# EAGLE design CT Amp (EAGLE 7.5.0)
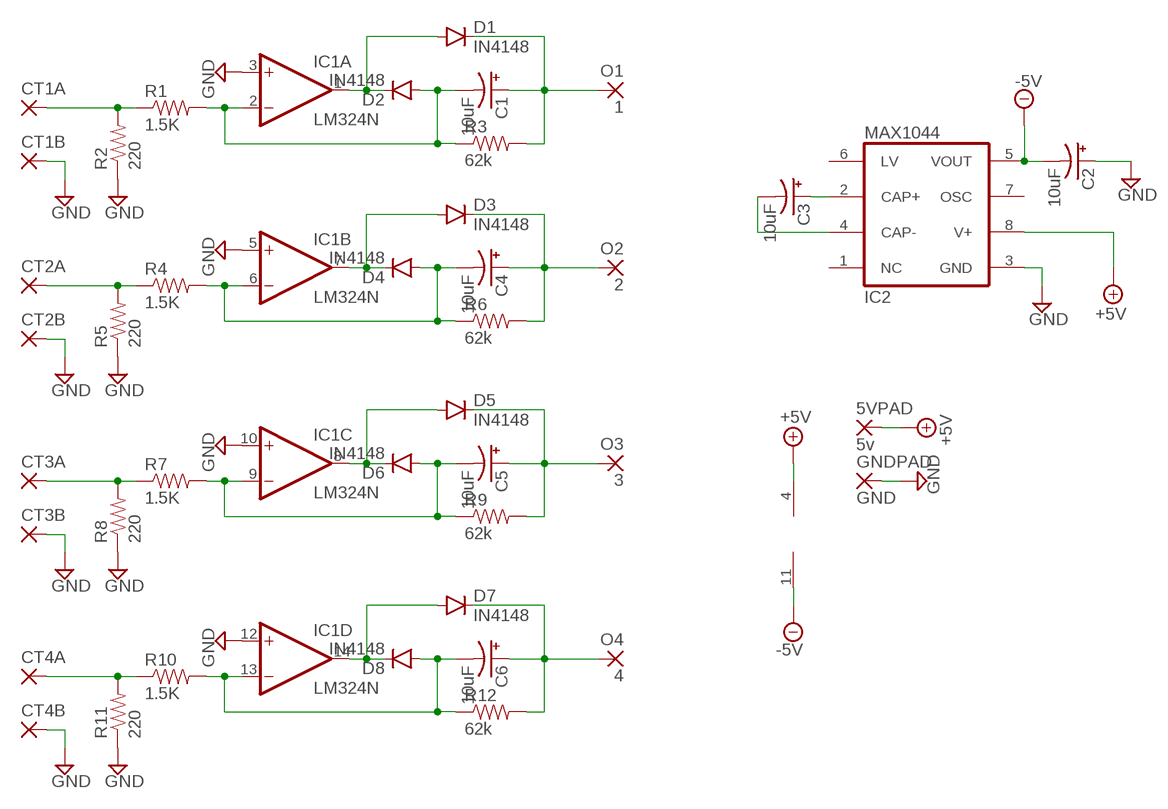
[diagram p0: schematic, sheet 1]

## Parts
5VPAD  5v  2,54/1,0  [2,54/1,0]
C1  10uF  CPOL-USE2.5-6  [E2,5-6]
C2  10uF  CPOL-USE2.5-6  [E2,5-6]
C3  10uF  CPOL-USE2.5-6  [E2,5-6]
C4  10uF  CPOL-USE2.5-6  [E2,5-6]
C5  10uF  CPOL-USE2.5-6  [E2,5-6]
C6  10uF  CPOL-USE2.5-6  [E2,5-6]
CT1A  2,54/1,0  [2,54/1,0]
CT1B  2,54/1,0  [2,54/1,0]
CT2A  2,54/1,0  [2,54/1,0]
CT2B  2,54/1,0  [2,54/1,0]
CT3A  2,54/1,0  [2,54/1,0]
CT3B  2,54/1,0  [2,54/1,0]
CT4A  2,54/1,0  [2,54/1,0]
CT4B  2,54/1,0  [2,54/1,0]
D1  IN4148  DIODEPTH  [DIODE-1N4001]
D2  IN4148  DIODEPTH  [DIODE-1N4001]
D3  IN4148  DIODEPTH  [DIODE-1N4001]
D4  IN4148  DIODEPTH  [DIODE-1N4001]
D5  IN4148  DIODEPTH  [DIODE-1N4001]
D6  IN4148  DIODEPTH  [DIODE-1N4001]
D7  IN4148  DIODEPTH  [DIODE-1N4001]
D8  IN4148  DIODEPTH  [DIODE-1N4001]
GNDPAD  GND  2,54/1,0  [2,54/1,0]
IC1  LM324N  [DIL14]
MAX1044  IC2  ICL7660CPA  [DIL08]
O1  1  2,54/1,0  [2,54/1,0]
O2  2  2,54/1,0  [2,54/1,0]
O3  3  2,54/1,0  [2,54/1,0]
O4  4  2,54/1,0  [2,54/1,0]
R1  1.5K  RESISTORPTH-1/4W  [AXIAL-0.4]
R2  220  RESISTORPTH-1/4W  [AXIAL-0.4]
R3  62k  RESISTORPTH-1/4W  [AXIAL-0.4]
R4  1.5K  RESISTORPTH-1/4W  [AXIAL-0.4]
R5  220  RESISTORPTH-1/4W  [AXIAL-0.4]
R6  62k  RESISTORPTH-1/4W  [AXIAL-0.4]
R7  1.5K  RESISTORPTH-1/4W  [AXIAL-0.4]
R8  220  RESISTORPTH-1/4W  [AXIAL-0.4]
R9  62k  RESISTORPTH-1/4W  [AXIAL-0.4]
R10  1.5K  RESISTORPTH-1/4W  [AXIAL-0.4]
R11  220  RESISTORPTH-1/4W  [AXIAL-0.4]
R12  62k  RESISTORPTH-1/4W  [AXIAL-0.4]

## Nets
+5V: 5VPAD.1(P) IC1.4(P:V+) MAX1044.8(V+)
-5V: C2.- IC1.11(P:V-) MAX1044.5(VOUT)
GND: C2.+ CT1B.1(P) CT2B.1(P) CT3B.1(P) CT4B.1(P) GNDPAD.1(P) IC1.3(A:+IN) IC1.5(B:+IN) IC1.10(C:+IN) IC1.12(D:+IN) MAX1044.3(GND) R2.P$1 R5.P$1 R8.P$1 R11.P$1
N$1: C3.+ MAX1044.2(CAP+)
N$2: C3.- MAX1044.4(CAP-)
N$3: CT2A.1(P) R4.P$1 R5.P$2
N$4: C1.- D2.A IC1.2(A:-IN) R1.P$2 R3.P$1
N$5: C5.- D6.A IC1.9(C:-IN) R7.P$2 R9.P$1
N$6: CT3A.1(P) R7.P$1 R8.P$2
N$8: D1.A D2.C IC1.1(A:OUT)
N$9: D5.A D6.C IC1.8(C:OUT)
N$10: C5.+ D5.C O3.1(P) R9.P$2
N$11: C6.- D8.A IC1.13(D:-IN) R10.P$2 R12.P$1
N$12: C4.- D4.A IC1.6(B:-IN) R4.P$2 R6.P$1
N$13: D7.A D8.C IC1.14(D:OUT)
N$14: C6.+ D7.C O4.1(P) R12.P$2
N$16: C1.+ D1.C O1.1(P) R3.P$2
N$17: CT1A.1(P) R1.P$1 R2.P$2
N$20: CT4A.1(P) R10.P$1 R11.P$2
N$21: D3.A D4.C IC1.7(B:OUT)
N$22: C4.+ D3.C O2.1(P) R6.P$2
Unconnected: MAX1044.1(NC) MAX1044.6(LV) MAX1044.7(OSC)

## Library data of the parts
5VPAD CT1A CT1B CT2A CT2B CT3A CT3B CT4A CT4B GNDPAD O1-O4 = wirepad:2,54/1,0: THROUGH-HOLE PAD
C1-C6 = adafruit:CPOL-US: POLARIZED CAPACITOR, American symbol
D1-D8 = SparkFun-DiscreteSemi:DIODE: Diode These are standard reverse protection diodes and small signal diodes. SMA package can handle up to about 1A. SOD-323 can handle about 200mA. What the SOD-323 package when ordering, there are some mfgs out there that are 5-pin packages.
IC1 = linear:LM324: OP AMP
MAX1044 = maxim:ICL7660CPA: VOLTAGE CONVERTER; MF: INTERSIL; MPN: ICL7660CPA; OC_FARNELL: 1018170; OC_NEWARK: 06F7441
R1-R12 = SparkFun-Resistors:RESISTOR: Resistor Basic schematic elements and footprints for 0603, 1206, and PTH resistors.

## Net classes
0 default: width 0.305 mm, drill 1 mm, clearance 0.254 mm

## Board
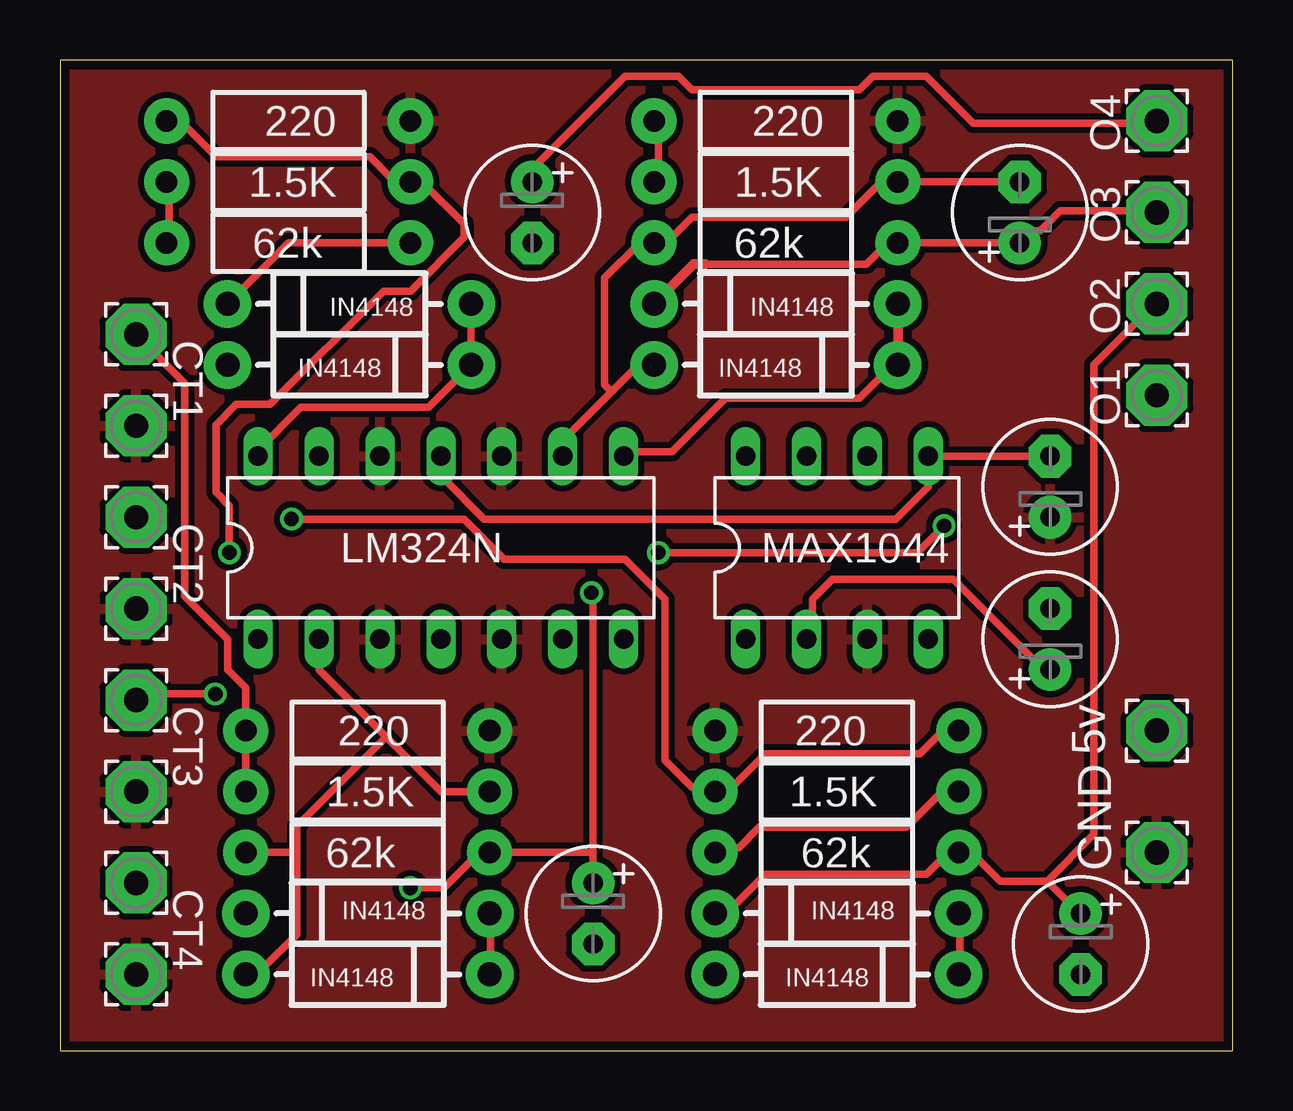
[diagram p1: board, top side]
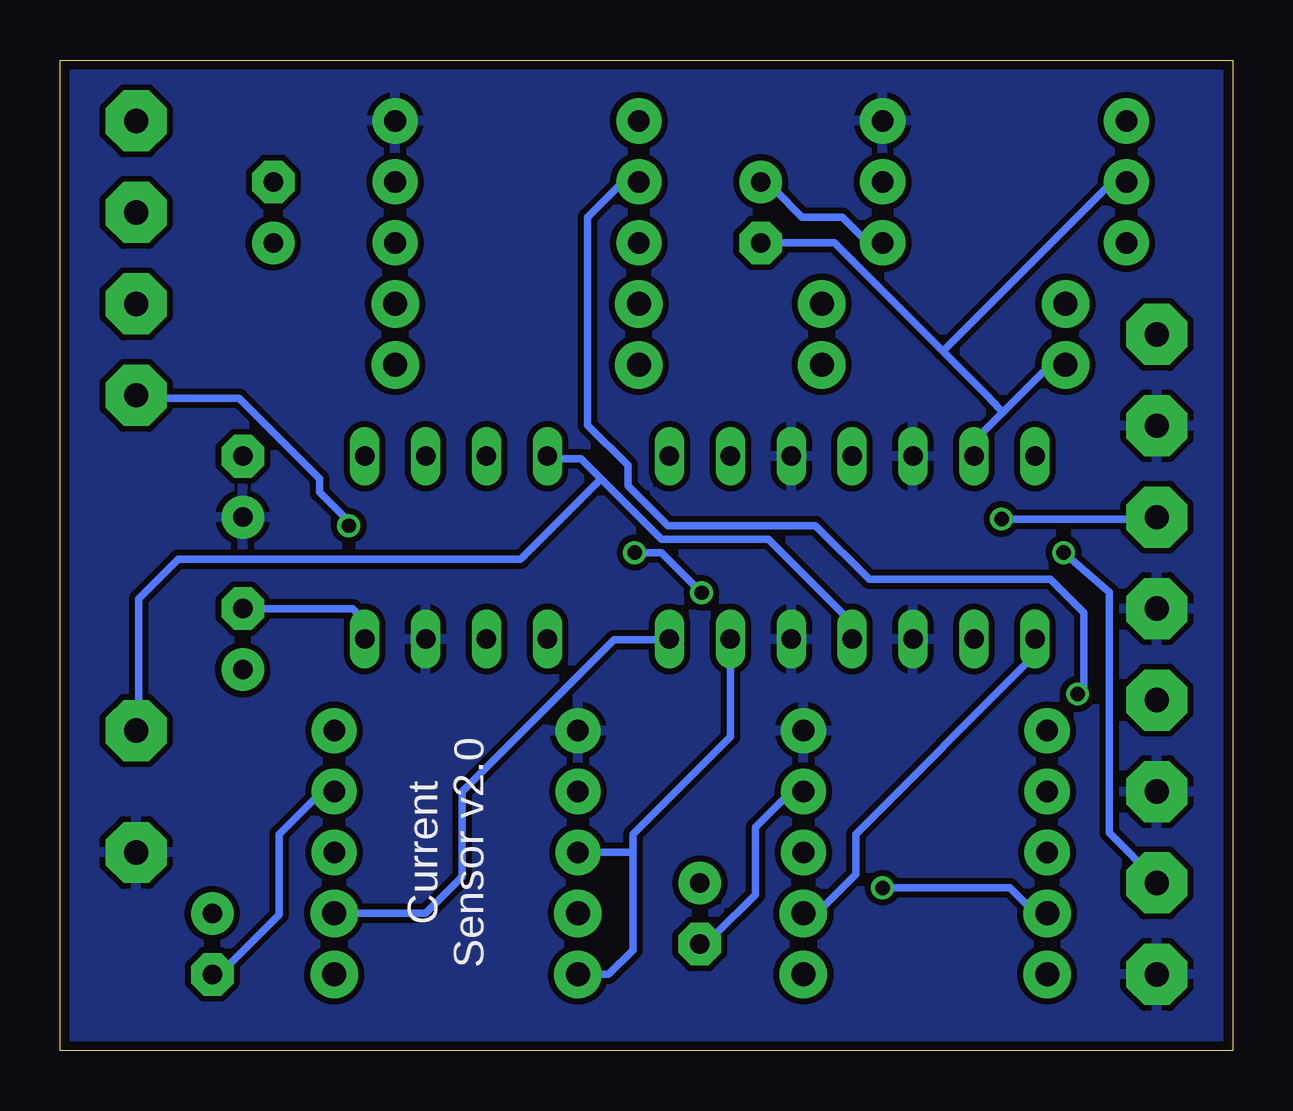
[diagram p2: board, bottom side, seen from below]

Size 48.89 x 41.27 mm. Coordinates in mm from the lower left corner, seen from the top.
Outline: 0,0 48.89,0 48.89,41.27 0,41.27 0,0
Copper layers (1*16): Top 0.0356mm / dielectric 1.5011mm / Bottom 0.0356mm
Design rules "OSH_Park": minimum track width 6mil, minimum drill 13mil, track to track 6mil, track to pad 6mil, pad to pad 6mil, via to via 6mil, smd to smd 6mil, copper to edge 15mil, drill to drill 6mil, minimum pad ring 7mil, minimum via ring 7mil, stop-mask expansion 4mil, vias tented up to drill 0mil, thermal gap 10mil

### Footprints (pad centres in the part's own frame; a part is rotated, then mirrored left to right if it is on the bottom)
2,54/1,0 = drill 1.016 pad 2.54 octagon: 1 0,0
E2,5-6 = drill 0.813 pad 1.778: + -1.27,0 | drill 0.813 pad 1.778 octagon: - 1.27,0
DIODE-1N4001 = drill 1 pad 1.981: A -5.08,0; C 5.08,0
DIL14 = drill 0.813 long: 1 -7.62,-3.81; 2 -5.08,-3.81; 3 -2.54,-3.81; 4 0,-3.81; 5 2.54,-3.81; 6 5.08,-3.81; 7 7.62,-3.81; 8 7.62,3.81; 9 5.08,3.81; 10 2.54,3.81; 11 0,3.81; 12 -2.54,3.81; 13 -5.08,3.81; 14 -7.62,3.81
DIL08 = drill 0.813 long: 1 -3.81,-3.81; 2 -1.27,-3.81; 3 1.27,-3.81; 4 3.81,-3.81; 5 3.81,3.81; 6 1.27,3.81; 7 -1.27,3.81; 8 -3.81,3.81
AXIAL-0.4 = drill 0.9 pad 1.88: P$1 -5.08,0; P$2 5.08,0

### Placement (x,y rotation side)
5VPAD  45.72,13.33 90 top
C1  22.23,5.71 270 top
C2  41.27,23.5 90 top
C3  41.27,17.15 90 top
C4  42.54,4.45 270 top
C5  40,34.92 90 top
C6  19.69,34.92 270 top
CT1A  3.17,29.85 270 top
CT1B  3.17,26.04 0 top
CT2A  3.17,22.23 270 top
CT2B  3.17,18.42 270 top
CT3A  3.17,14.61 270 top
CT3B  3.17,10.79 270 top
CT4A  3.17,6.98 270 top
CT4B  3.17,3.17 270 top
D1  12.83,5.71 180 top
D2  12.83,3.17 0 top
D3  32.38,5.71 180 top
D4  32.38,3.17 0 top
D5  29.85,31.12 180 top
D6  29.85,28.58 0 top
D7  12.06,31.12 180 top
D8  12.06,28.58 0 top
GNDPAD  45.72,8.26 90 top
IC1  15.88,20.96 0 top
MAX1044  32.38,20.96 0 top
O1  45.72,27.31 90 top
O2  45.72,31.12 90 top
O3  45.72,34.92 90 top
O4  45.72,38.73 90 top
R1  12.83,10.79 0 top
R2  12.83,13.33 180 top
R3  12.83,8.26 0 top
R4  32.38,10.79 0 top
R5  32.38,13.33 0 top
R6  32.38,8.26 0 top
R7  29.85,36.2 0 top
R8  29.85,38.73 180 top
R9  29.85,33.66 0 top
R10  9.53,36.2 180 top
R11  9.53,38.73 180 top
R12  9.53,33.66 0 top

### Tracks (layer width: path | path; a pad name or v marks a point on that pad's centre or on a via)
+5V
  Bottom 0.305: 26.34,23.83 27.18,24.66 28.58,24.66 MAX1044.8 | 26.34,23.83 23.83,21.31 19.36,21.31 16,17.96 16,17.4 IC1.4 | 26.34,23.83 29.69,20.47 43.97,20.47 45.62,18.82 45.62,13.49 5VPAD.1
-5V
  Top 0.305: IC1.11 16,24.66 16,23.83 17.68,22.15 34.85,22.15 36.2,23.5 MAX1044.5 | 36.12,24.66 MAX1044.5 | MAX1044.5 C2.-
GND
  pour Top: -0.64,42.54 48.89,43.81 48.89,-0.64 -0.64,-0.64
  pour Bottom: -0.64,41.27 51.43,41.27 50.16,-0.64 -0.64,-0.64
N$1
  Top 0.305: MAX1044.2 31.37,17.4 31.37,18.8 32.21,19.63 37.24,19.63 40.59,16.28 41.15,16.28 C3.+
N$2
  Bottom 0.305: MAX1044.4 36.2,17.91 36.7,18.42 C3.-
N$3  (via drill 0.6)
  Top 0.305: R5.P$2 37.24,13.21 36.68,13.21 35.84,12.37 29.41,12.37 28.02,10.97 27.46,10.97 R4.P$1 27.18,10.97 26.34,10.97 25.22,12.09 25.22,18.8 23.55,20.47 18.52,20.47 16.84,22.15 v9.65,22.15
  Bottom 0.305: v9.65,22.15 3.43,22.15 CT2A.1
N$4
  Top 0.305: 9.86,8.26 9.86,9.35 13.59,13.08 | 9.86,8.26 9.86,4.83 8.46,3.43 7.9,3.43 D2.A | IC1.2 10.79,15.88 13.59,13.08 | 13.59,13.08 15.88,10.79 R1.P$2 | R3.P$1 9.86,8.26
  Bottom 0.305: C1.- 22.15,4.83 21.59,4.83 19.91,6.5 19.91,9.3 18.52,10.69 17.96,10.69 R1.P$2
N$5
  Top 0.305: 22.99,27.46 24.11,28.58 D6.A | 22.99,27.46 21.03,25.5 21.03,24.94 IC1.9 | 22.99,27.46 22.71,27.74 22.71,32.21 24.11,33.6 24.66,33.6 R9.P$1 24.94,33.88 25.5,33.88 26.34,34.72 32.77,34.72 34.16,36.12 34.72,36.12 R7.P$2 C5.-
N$6  (via drill 0.6)
  Top 0.305: R7.P$1 24.94,36.4 24.94,38.63 R8.P$2 | v6.48,14.86 3.43,14.86 CT3A.1
  Bottom 0.305: R7.P$1 24.94,36.12 25.5,36.12 26.9,34.72 26.9,26.06 25.22,24.38 25.22,23.55 23.55,21.87 17.4,21.87 15.16,19.63 7.62,19.63 6.22,18.24 6.22,15.11 v6.48,14.86
N$8
  Top 0.305: D2.C 17.96,3.43 17.96,5.66 D1.A
  Bottom 0.305: IC1.1 8.46,17.12 8.46,16.28 15.72,9.02 15.72,7.34 17.12,5.94 17.68,5.94 D1.A
N$9
  Top 0.305: IC1.8 23.55,24.94 25.5,24.94 27.74,27.18 33.32,27.18 34.72,28.58 D6.C 35,28.58
  Top 0.406: D5.A D6.C
N$10
  Top 0.305: O3.1 45.62,35 41.71,35 40.87,34.16 40.03,34.16 C5.+ R9.P$2 34.72,33.88 33.6,32.77 26.9,32.77
  Top 0.406: 26.9,32.77 26.42,32.77 D5.C
N$11
  Top 0.305: R12.P$1 4.55,33.88 4.55,36.12 R10.P$2
  Bottom 0.305: 9.59,26.61 7.62,28.58 D8.A | 9.59,26.61 10.69,25.5 10.69,24.94 IC1.13 | 12.09,29.13 10.13,27.18 10.13,27.15 9.59,26.61 | 12.09,29.13 16.61,33.66 19.05,33.66 19.08,33.88 19.63,33.88 C6.- | 12.09,29.13 5.1,36.12 4.55,36.12 R10.P$2
N$12
  Top 0.305: R4.P$2 37.24,10.69 36.68,10.69 35.28,9.3 29.13,9.3 28.3,8.46 27.46,8.46 R6.P$1
  Bottom 0.305: C4.- 41.99,3.43 39.75,5.66 39.75,9.02 38.07,10.69 37.52,10.69 R4.P$2 | IC1.6 20.96,13.08 25.02,9.02 25.02,8.26 | 25.02,8.26 25.02,4.19 26.04,3.17 D4.A | R6.P$1 25.02,8.26
N$13
  Top 0.305: IC1.14 8.26,25.02 10.03,26.8 15.37,26.8 D8.C D7.A
N$14
  Top 0.305: O4.1 45.62,38.63 38.07,38.63 36.12,40.59 33.88,40.59 33.32,40.03 26.34,40.03 25.78,40.59 23.55,40.59 19.63,36.68 19.63,36.12 C6.+ | D7.C 9.53,33.66 R12.P$2
  Bottom 0.305: C6.+ 19.63,35.84 19.08,35.84 17.96,34.72 16.28,34.72 15.44,33.88 14.61,33.88 R12.P$2
N$16  (via drill 0.6)
  Top 0.305: v14.61,6.78 16,6.78 17.68,8.46 R3.P$2 22.23,8.26 | v24.94,20.75 35.74,20.75 v36.85,21.87 | v22.15,19.08 22.23,19.08 22.23,8.26 | 22.23,8.26 C1.+
  Bottom 0.305: v14.61,6.78 9.3,6.78 8.46,5.94 7.9,5.94 D1.C | v36.85,21.87 36.68,21.87 38.07,23.27 38.07,23.83 41.43,27.18 45.62,27.18 O1.1 | v24.94,20.75 23.83,20.75 v22.15,19.08
N$17
  Top 0.305: CT1A.1 5.21,27.81 5.21,18.92 6.98,17.15 6.98,15.88 7.75,15.11 R2.P$2 R1.P$1
N$20  (via drill 0.6)
  Top 0.305: R11.P$2 4.55,38.63 5.1,38.63 6.5,37.24 12.93,37.24 13.77,36.4 14.61,36.4 R10.P$1 14.61,36.12 15.16,36.12 16.84,34.44 16.84,33.88 14.61,31.65 13.49,31.65 8.76,26.92 7.34,26.92 6.5,26.09 6.5,23.27 7.06,22.71 v7.06,20.75
  Bottom 0.305: v7.06,20.75 5.16,19.1 5.16,9.07 3.17,7.09 CT4A.1
N$21
  Top 0.305: D4.C 37.52,3.43 37.52,5.66 D3.A
  Bottom 0.305: IC1.7 23.55,17.12 25.81,17.12 32.13,10.79 32.13,7.24 33.66,5.71 D3.A
N$22
  Top 0.305: 41.15,7.06 42.54,5.66 C4.+ | 41.15,7.06 39.19,7.06 38.07,8.18 37.52,8.18 R6.P$2 37.24,8.46 36.12,7.34 29.41,7.34 28.02,5.94 27.46,5.94 D3.C | 41.15,7.06 43.1,9.02 43.1,28.58 45.62,31.09 O2.1

### Text on the board
tNames: CT1 | CT2 | CT3 | 5v | GND | CT4
bNames: Current / Sensor v2.0